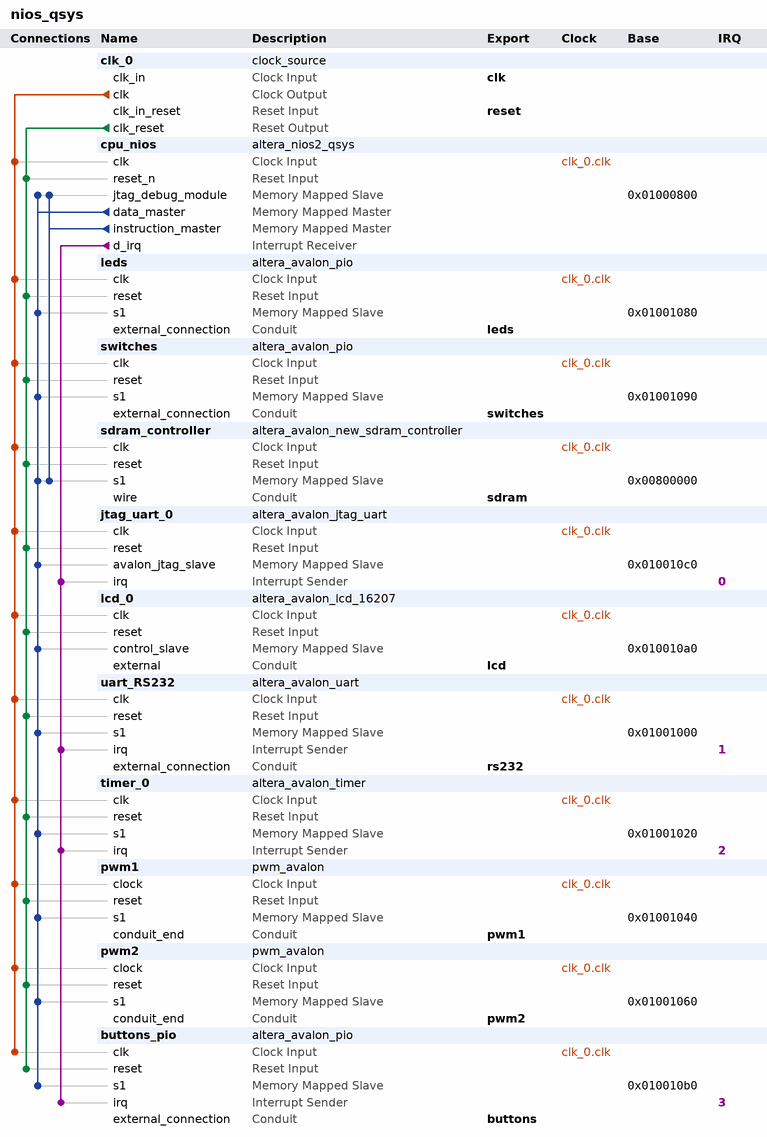
[diagram p0: system contents]
# Platform Designer (Qsys) system nios_qsys
# Parameters at their usual value, and those the tool derives, are not listed.
package require -exact qsys 11.0
create_system nios_qsys
set_project_property DEVICE_FAMILY CYCLONEII

add_instance clk_0 clock_source 11.0
set_instance_parameter_value clk_0 clockFrequency 50000000

add_instance cpu_nios altera_nios2_qsys 11.0
set_instance_parameter_value cpu_nios manuallyAssignCpuID false
set_instance_parameter_value cpu_nios resetSlave sdram_controller.s1
set_instance_parameter_value cpu_nios exceptionSlave sdram_controller.s1
set_instance_parameter_value cpu_nios breakSlave cpu_nios.jtag_debug_module
set_instance_parameter_value cpu_nios impl Small
set_instance_parameter_value cpu_nios icache_size 4096

add_instance leds altera_avalon_pio 11.0
set_instance_parameter_value leds direction Output
set_instance_parameter_value leds width 18

add_instance switches altera_avalon_pio 11.0
set_instance_parameter_value switches direction Input
set_instance_parameter_value switches width 18

add_instance sdram_controller altera_avalon_new_sdram_controller 11.0
set_instance_parameter_value sdram_controller TAC 5.5
set_instance_parameter_value sdram_controller TRCD 20.0
set_instance_parameter_value sdram_controller TRP 20.0
set_instance_parameter_value sdram_controller casLatency 3
set_instance_parameter_value sdram_controller columnWidth 8
set_instance_parameter_value sdram_controller dataWidth 16
set_instance_parameter_value sdram_controller generateSimulationModel true
set_instance_parameter_value sdram_controller model custom
set_instance_parameter_value sdram_controller numberOfBanks 4
set_instance_parameter_value sdram_controller numberOfChipSelects 1
set_instance_parameter_value sdram_controller powerUpDelay 100.0
set_instance_parameter_value sdram_controller refreshPeriod 15.625
set_instance_parameter_value sdram_controller rowWidth 12

add_instance jtag_uart_0 altera_avalon_jtag_uart 11.0
set_instance_parameter_value jtag_uart_0 simInteractiveOptions INTERACTIVE_ASCII_OUTPUT

add_instance lcd_0 altera_avalon_lcd_16207 11.0

add_instance uart_RS232 altera_avalon_uart 11.0
set_instance_parameter_value uart_RS232 baud 9600
set_instance_parameter_value uart_RS232 dataBits 8
set_instance_parameter_value uart_RS232 fixedBaud true
set_instance_parameter_value uart_RS232 parity NONE
set_instance_parameter_value uart_RS232 stopBits 1

add_instance timer_0 altera_avalon_timer 11.0
set_instance_parameter_value timer_0 period 10
set_instance_parameter_value timer_0 periodUnits MSEC
set_instance_parameter_value timer_0 timerPreset CUSTOM

add_instance pwm1 pwm_avalon 1.0

add_instance pwm2 pwm_avalon 1.0

add_instance buttons_pio altera_avalon_pio 11.0
set_instance_parameter_value buttons_pio captureEdge true
set_instance_parameter_value buttons_pio direction Input
set_instance_parameter_value buttons_pio edgeType ANY
set_instance_parameter_value buttons_pio generateIRQ true
set_instance_parameter_value buttons_pio irqType EDGE
set_instance_parameter_value buttons_pio width 3

# connections
add_connection clk_0.clk buttons_pio.clk clock
add_connection clk_0.clk cpu_nios.clk clock
add_connection clk_0.clk jtag_uart_0.clk clock
add_connection clk_0.clk lcd_0.clk clock
add_connection clk_0.clk leds.clk clock
add_connection clk_0.clk pwm1.clock clock
add_connection clk_0.clk pwm2.clock clock
add_connection clk_0.clk sdram_controller.clk clock
add_connection clk_0.clk switches.clk clock
add_connection clk_0.clk timer_0.clk clock
add_connection clk_0.clk uart_RS232.clk clock
add_connection clk_0.clk_reset buttons_pio.reset reset
add_connection clk_0.clk_reset cpu_nios.reset_n reset
add_connection clk_0.clk_reset jtag_uart_0.reset reset
add_connection clk_0.clk_reset lcd_0.reset reset
add_connection clk_0.clk_reset leds.reset reset
add_connection clk_0.clk_reset pwm1.reset reset
add_connection clk_0.clk_reset pwm2.reset reset
add_connection clk_0.clk_reset sdram_controller.reset reset
add_connection clk_0.clk_reset switches.reset reset
add_connection clk_0.clk_reset timer_0.reset reset
add_connection clk_0.clk_reset uart_RS232.reset reset
add_connection cpu_nios.data_master buttons_pio.s1 avalon
set_connection_parameter_value cpu_nios.data_master/buttons_pio.s1 baseAddress 0x010010b0
add_connection cpu_nios.data_master cpu_nios.jtag_debug_module avalon
set_connection_parameter_value cpu_nios.data_master/cpu_nios.jtag_debug_module baseAddress 0x01000800
add_connection cpu_nios.data_master jtag_uart_0.avalon_jtag_slave avalon
set_connection_parameter_value cpu_nios.data_master/jtag_uart_0.avalon_jtag_slave baseAddress 0x010010c0
add_connection cpu_nios.data_master lcd_0.control_slave avalon
set_connection_parameter_value cpu_nios.data_master/lcd_0.control_slave baseAddress 0x010010a0
add_connection cpu_nios.data_master leds.s1 avalon
set_connection_parameter_value cpu_nios.data_master/leds.s1 baseAddress 0x01001080
add_connection cpu_nios.data_master pwm1.s1 avalon
set_connection_parameter_value cpu_nios.data_master/pwm1.s1 baseAddress 0x01001040
add_connection cpu_nios.data_master pwm2.s1 avalon
set_connection_parameter_value cpu_nios.data_master/pwm2.s1 baseAddress 0x01001060
add_connection cpu_nios.data_master sdram_controller.s1 avalon
set_connection_parameter_value cpu_nios.data_master/sdram_controller.s1 baseAddress 0x00800000
add_connection cpu_nios.data_master switches.s1 avalon
set_connection_parameter_value cpu_nios.data_master/switches.s1 baseAddress 0x01001090
add_connection cpu_nios.data_master timer_0.s1 avalon
set_connection_parameter_value cpu_nios.data_master/timer_0.s1 baseAddress 0x01001020
add_connection cpu_nios.data_master uart_RS232.s1 avalon
set_connection_parameter_value cpu_nios.data_master/uart_RS232.s1 baseAddress 0x01001000
add_connection cpu_nios.instruction_master cpu_nios.jtag_debug_module avalon
set_connection_parameter_value cpu_nios.instruction_master/cpu_nios.jtag_debug_module baseAddress 0x01000800
add_connection cpu_nios.instruction_master sdram_controller.s1 avalon
set_connection_parameter_value cpu_nios.instruction_master/sdram_controller.s1 baseAddress 0x00800000
add_connection cpu_nios.d_irq buttons_pio.irq interrupt
set_connection_parameter_value cpu_nios.d_irq/buttons_pio.irq irqNumber 3
add_connection cpu_nios.d_irq jtag_uart_0.irq interrupt
set_connection_parameter_value cpu_nios.d_irq/jtag_uart_0.irq irqNumber 0
add_connection cpu_nios.d_irq timer_0.irq interrupt
set_connection_parameter_value cpu_nios.d_irq/timer_0.irq irqNumber 2
add_connection cpu_nios.d_irq uart_RS232.irq interrupt
set_connection_parameter_value cpu_nios.d_irq/uart_RS232.irq irqNumber 1

# exported interfaces
add_interface clk clock sink
set_interface_property clk EXPORT_OF clk_0.clk_in
add_interface reset reset sink
set_interface_property reset EXPORT_OF clk_0.clk_in_reset
add_interface leds conduit end
set_interface_property leds EXPORT_OF leds.external_connection
add_interface switches conduit end
set_interface_property switches EXPORT_OF switches.external_connection
add_interface sdram conduit end
set_interface_property sdram EXPORT_OF sdram_controller.wire
add_interface lcd conduit end
set_interface_property lcd EXPORT_OF lcd_0.external
add_interface rs232 conduit end
set_interface_property rs232 EXPORT_OF uart_RS232.external_connection
add_interface pwm1 conduit end
set_interface_property pwm1 EXPORT_OF pwm1.conduit_end
add_interface pwm2 conduit end
set_interface_property pwm2 EXPORT_OF pwm2.conduit_end
add_interface buttons conduit end
set_interface_property buttons EXPORT_OF buttons_pio.external_connection

save_system nios_qsys.qsys
